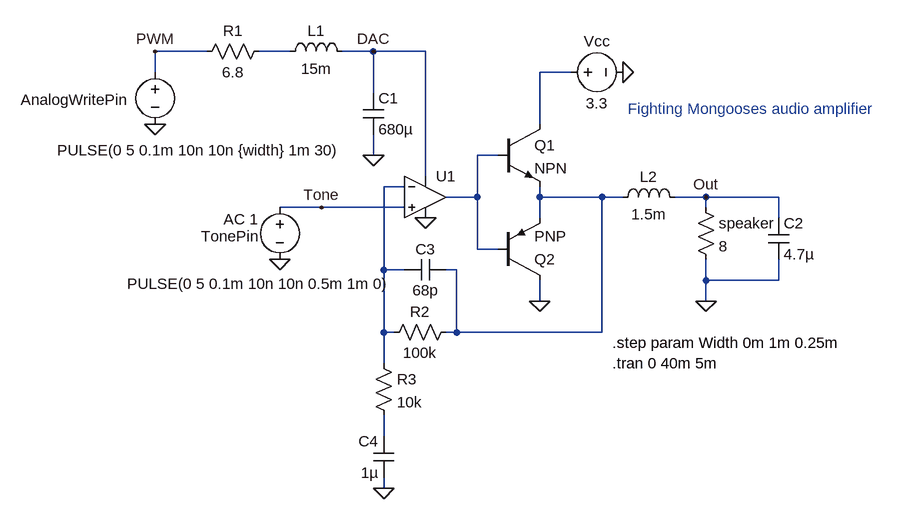
[diagram p0: schematic ArduinoAudio3.asc]
ArduinoAudio3.asc, the LTspice schematic file:
Version 4
SHEET 1 1272 680
WIRE 208 -416 128 -416
WIRE 336 -416 288 -416
WIRE 464 -416 416 -416
WIRE 544 -416 464 -416
WIRE 128 -384 128 -416
WIRE 768 -384 720 -384
WIRE 464 -352 464 -416
WIRE 720 -304 720 -384
WIRE 464 -256 464 -288
WIRE 656 -256 624 -256
WIRE 544 -224 544 -416
WIRE 512 -208 480 -208
WIRE 624 -192 624 -256
WIRE 624 -192 576 -192
WIRE 720 -192 720 -208
WIRE 816 -192 720 -192
WIRE 848 -192 816 -192
WIRE 976 -192 928 -192
WIRE 1088 -192 976 -192
WIRE 384 -176 320 -176
WIRE 512 -176 384 -176
WIRE 976 -176 976 -192
WIRE 720 -160 720 -192
WIRE 1088 -160 1088 -192
WIRE 624 -112 624 -192
WIRE 656 -112 624 -112
WIRE 480 -80 480 -208
WIRE 512 -80 480 -80
WIRE 592 -80 576 -80
WIRE 976 -64 976 -96
WIRE 1088 -64 1088 -96
WIRE 1088 -64 976 -64
WIRE 720 -32 720 -64
WIRE 976 -32 976 -64
WIRE 480 16 480 -80
WIRE 496 16 480 16
WIRE 592 16 592 -80
WIRE 592 16 576 16
WIRE 816 16 816 -192
WIRE 816 16 592 16
WIRE 480 64 480 16
WIRE 480 176 480 144
WIRE 480 256 480 240
FLAG 320 -96 0
FLAG 128 -304 0
FLAG 464 -256 0
FLAG 128 -416 PWM
FLAG 464 -416 DAC
FLAG 384 -176 Tone
FLAG 848 -384 0
FLAG 976 -32 0
FLAG 976 -192 Out
FLAG 480 256 0
FLAG 720 -32 0
FLAG 544 -160 0
SYMBOL voltage 320 -192 R0
WINDOW 0 -121 60 Left 2
WINDOW 3 -235 133 Left 2
WINDOW 123 -87 34 Left 2
WINDOW 39 0 0 Left 0
SYMATTR InstName TonePin
SYMATTR Value PULSE(0 5 0.1m 10n 10n 0.5m 1m 0)
SYMATTR Value2 AC 1
SYMBOL voltage 128 -400 R0
WINDOW 0 -124 74 Bottom 2
WINDOW 3 68 120 Top 2
WINDOW 123 0 0 Left 0
WINDOW 39 0 0 Left 0
SYMATTR InstName AnalogWritePin
SYMATTR Value PULSE(0 5 0.1m 10n 10n {width} 1m 30)
SYMBOL cap 448 -352 R0
SYMATTR InstName C1
SYMATTR Value 680µ
SYMBOL ind 320 -400 R270
WINDOW 0 32 56 VTop 2
WINDOW 3 5 56 VBottom 2
SYMATTR InstName L1
SYMATTR Value 15m
SYMBOL res 304 -432 R90
WINDOW 0 0 56 VBottom 2
WINDOW 3 32 56 VTop 2
SYMATTR InstName R1
SYMATTR Value 6.8
SYMBOL voltage 752 -384 R270
WINDOW 0 32 56 VTop 2
WINDOW 3 -32 56 VBottom 2
WINDOW 123 0 0 Left 0
WINDOW 39 0 0 Left 0
SYMATTR InstName Vcc
SYMATTR Value 3.3
SYMBOL res 960 -192 R0
SYMATTR InstName speaker
SYMATTR Value 8
SYMBOL Opamps\\UniversalOpamp2 544 -192 R0
SYMATTR InstName U1
SYMBOL npn 656 -304 R0
SYMATTR InstName Q1
SYMBOL pnp 656 -64 M180
SYMATTR InstName Q2
SYMBOL cap 1072 -160 R0
SYMATTR InstName C2
SYMATTR Value 4.7µ
SYMBOL cap 576 -96 R90
WINDOW 0 0 32 VBottom 2
WINDOW 3 32 32 VTop 2
SYMATTR InstName C3
SYMATTR Value 68p
SYMBOL cap 496 240 R180
WINDOW 0 24 56 Left 2
WINDOW 3 24 8 Left 2
SYMATTR InstName C4
SYMATTR Value 1µ
SYMBOL res 592 0 R90
WINDOW 0 0 56 VBottom 2
WINDOW 3 32 56 VTop 2
SYMATTR InstName R2
SYMATTR Value 100k
SYMBOL res 464 48 R0
SYMATTR InstName R3
SYMATTR Value 10k
SYMBOL ind 832 -176 R270
WINDOW 0 32 56 VTop 2
WINDOW 3 5 56 VBottom 2
SYMATTR InstName L2
SYMATTR Value 1.5m
TEXT 832 64 Left 2 !.tran 0 40m 5m
TEXT 832 32 Left 2 !.step param Width 0m 1m 0.25m
TEXT 856 -328 Left 2 ;Fighting Mongooses audio amplifier

The netlist it stands for:
* ArduinoAudio3.asc
V§TonePin Tone 0 PULSE(0 5 0.1m 10n 10n 0.5m 1m 0) AC 1
V§AnalogWritePin PWM 0 PULSE(0 5 0.1m 10n 10n {width} 1m 30)
C1 DAC 0 680µ
L1 N001 DAC 15m
R1 N001 PWM 6.8
Vcc N002 0 3.3
R§speaker Out 0 8
XU1 Tone N004 DAC 0 N003 level.2 Avol=1Meg GBW=10Meg Slew=10Meg ilimit=25m rail=0 Vos=0 phimargin=45 en=0 enk=0 in=0 ink=0 Rin=500Meg  ; pins IN+ IN- V+ V- OUT
Q1 N002 N003 N005 0 NPN
Q2 0 N003 N005 0 PNP
C2 Out 0 4.7µ
C3 N005 N004 68p
C4 0 N006 1µ
R2 N005 N004 100k
R3 N004 N006 10k
L2 N005 Out 1.5m
.model NPN NPN
.model PNP PNP
.lib standard.bjt
.tran 0 40m 5m
.step param Width 0m 1m 0.25m
* Fighting Mongooses audio amplifier
.lib UniversalOpamps2.sub
.backanno
.end